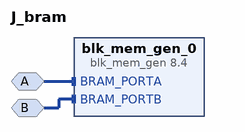
[diagram p0: block diagram of the top level]
# Vivado block design J_bram, xc7z020clg484-1, Vivado 2024.2
create_bd_design J_bram

create_bd_intf_port -mode Slave -vlnv xilinx.com:interface:bram_rtl:1.0 A
create_bd_intf_port -mode Slave -vlnv xilinx.com:interface:bram_rtl:1.0 B

create_bd_cell -type ip -vlnv xilinx.com:ip:blk_mem_gen:8.4 blk_mem_gen_0
set_property -dict [list \
  CONFIG.Algorithm Fixed_Primitives \
  CONFIG.Coe_File ../../../../coe/k2000.coe \
  CONFIG.Enable_A Always_Enabled \
  CONFIG.Enable_B Always_Enabled \
  CONFIG.Load_Init_File true \
  CONFIG.Memory_Type Dual_Port_ROM \
  CONFIG.Primitive 512x36 \
  CONFIG.Register_PortA_Output_of_Memory_Primitives false \
  CONFIG.Register_PortB_Output_of_Memory_Primitives false \
  CONFIG.Write_Depth_A 1024 \
  CONFIG.Write_Width_A 3204 \
  CONFIG.use_bram_block Stand_Alone \
] [get_bd_cells blk_mem_gen_0]

# ---- connections ----

connect_bd_intf_net -intf_net BRAM_PORTA_0_1 [get_bd_intf_ports A] [get_bd_intf_pins blk_mem_gen_0/BRAM_PORTA]
connect_bd_intf_net -intf_net BRAM_PORTB_0_1 [get_bd_intf_ports B] [get_bd_intf_pins blk_mem_gen_0/BRAM_PORTB]

validate_bd_design
save_bd_design
